# Altium schematic sheet Cpcis_connectors_P4_P5_P6.SchDoc: CPCIS Backplane
size 420 x 297 mm; CheckedBy: A.Paixao; CompanyName: CERN; DrawnBy: G. Daniluk; Engineer: G. Daniluk; Organization: CERN; Address1: European Organization for Nuclear Research; Address2: CH-1211 Genève 23 - Switzerland; DocumentNumber: 19; Revision: -; SheetNumber: 19; SheetTotal: 19; EDA_Number: EDA-03828-V1-0; Projet: DIOT Demonstrator System Board (based on C-GEFE v1); ModifiedBy: G. Daniluk; CheckedDate: 18/06/2018; Title2: P5 to P6; DivGrp: BE/CO; Designer: G. Daniluk; ModifiedDate: -
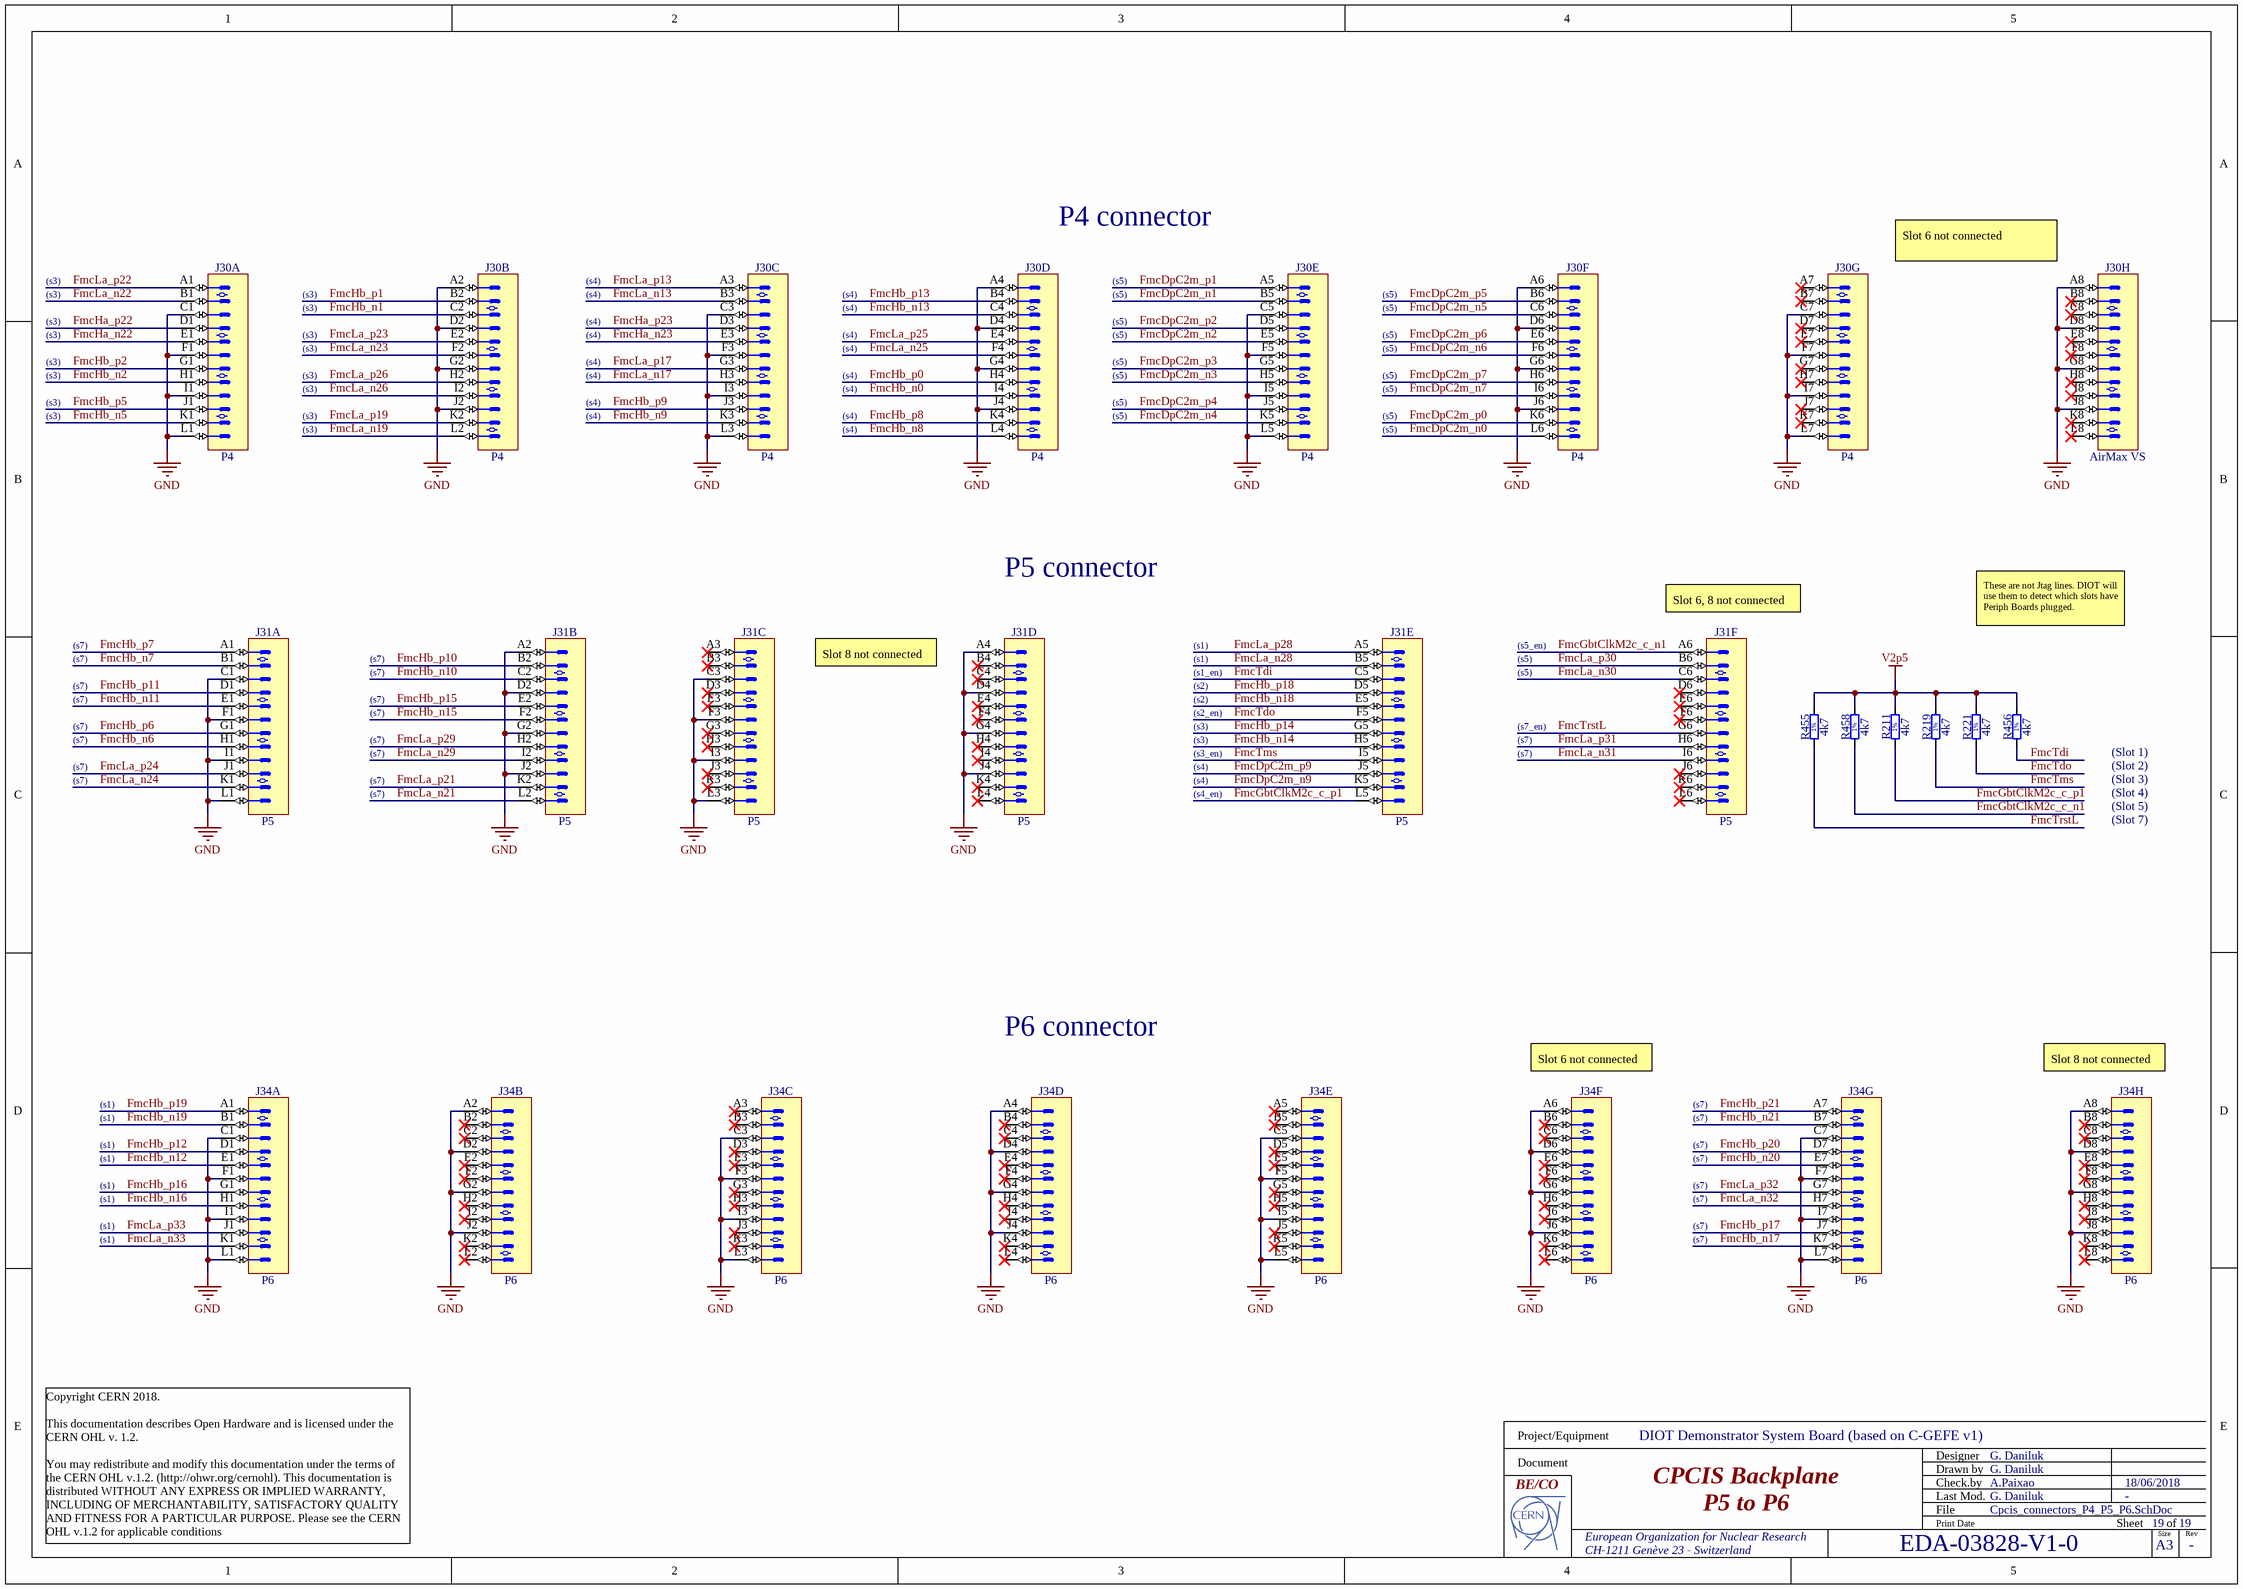
[diagram p0: Cpcis_connectors_P4_P5_P6.SchDoc]

## Parts
J30  P4  [AMPHENOL_10052837-101LF]  (parts A,B,C,D,E,F,G,H of 8)
J31  P5  [AMPHENOL_10052824-101LF]  (parts A,B,C,D,E,F of 6)
J34  P6  [AMPHENOL_10052838-101LF]  (parts A,B,C,D,E,F,G,H of 8)
R211  4k7  [RESC1005X40N]
R219  4k7  [RESC1005X40N]
R221  4k7  [RESC1005X40N]
R455  4k7  [RESC1005X40N]
R456  4k7  [RESC1005X40N]
R458  4k7  [RESC1005X40N]

## Nets
GND: J30.A2 J30.A4 J30.A6 J30.A8 J30.C1 J30.C3 J30.C5 J30.C7 J30.D2 J30.D4 J30.D6 J30.D8 J30.F1 J30.F3 J30.F5 J30.F7 J30.G2 J30.G4 J30.G6 J30.G8 J30.I1 J30.I3 J30.I5 J30.I7 J30.J2 J30.J4 J30.J6 J30.J8 J30.L1 J30.L3 J30.L5 J30.L7 J31.A2 J31.A4 J31.C1 J31.C3 J31.D2 J31.D4 J31.F1 J31.F3 J31.G2 J31.G4 J31.I1 J31.I3 J31.J2 J31.J4 J31.L1 J31.L3 J34.A2 J34.A4 J34.A6 J34.A8 J34.C1 J34.C3 J34.C5 J34.C7 J34.D2 J34.D4 J34.D6 J34.D8 J34.F1 J34.F3 J34.F5 J34.F7 J34.G2 J34.G4 J34.G6 J34.G8 J34.I1 J34.I3 J34.I5 J34.I7 J34.J2 J34.J4 J34.J6 J34.J8 J34.L1 J34.L3 J34.L5 J34.L7
V2p5: R211.2 R219.2 R221.2 R455.2 R456.2 R458.2
FmcDpC2m_n0: J30.L6
FmcDpC2m_n1: J30.B5
FmcDpC2m_n2: J30.E5
FmcDpC2m_n3: J30.H5
FmcDpC2m_n4: J30.K5
FmcDpC2m_n5: J30.C6
FmcDpC2m_n6: J30.F6
FmcDpC2m_n7: J30.I6
FmcDpC2m_n9: J31.K5
FmcDpC2m_p0: J30.K6
FmcDpC2m_p1: J30.A5
FmcDpC2m_p2: J30.D5
FmcDpC2m_p3: J30.G5
FmcDpC2m_p4: J30.J5
FmcDpC2m_p5: J30.B6
FmcDpC2m_p6: J30.E6
FmcDpC2m_p7: J30.H6
FmcDpC2m_p9: J31.J5
FmcGbtClkM2c_c_n1: J31.A6 R458.1
FmcGbtClkM2c_c_p1: J31.L5 R211.1
FmcHa_n22: J30.E1
FmcHa_n23: J30.E3
FmcHa_p22: J30.D1
FmcHa_p23: J30.D3
FmcHb_n0: J30.I4
FmcHb_n1: J30.C2
FmcHb_n2: J30.H1
FmcHb_n5: J30.K1
FmcHb_n6: J31.H1
FmcHb_n7: J31.B1
FmcHb_n8: J30.L4
FmcHb_n9: J30.K3
FmcHb_n10: J31.C2
FmcHb_n11: J31.E1
FmcHb_n12: J34.E1
FmcHb_n13: J30.C4
FmcHb_n14: J31.H5
FmcHb_n15: J31.F2
FmcHb_n16: J34.H1
FmcHb_n17: J34.K7
FmcHb_n18: J31.E5
FmcHb_n19: J34.B1
FmcHb_n20: J34.E7
FmcHb_n21: J34.B7
FmcHb_p0: J30.H4
FmcHb_p1: J30.B2
FmcHb_p2: J30.G1
FmcHb_p5: J30.J1
FmcHb_p6: J31.G1
FmcHb_p7: J31.A1
FmcHb_p8: J30.K4
FmcHb_p9: J30.J3
FmcHb_p10: J31.B2
FmcHb_p11: J31.D1
FmcHb_p12: J34.D1
FmcHb_p13: J30.B4
FmcHb_p14: J31.G5
FmcHb_p15: J31.E2
FmcHb_p16: J34.G1
FmcHb_p17: J34.J7
FmcHb_p18: J31.D5
FmcHb_p19: J34.A1
FmcHb_p20: J34.D7
FmcHb_p21: J34.A7
FmcLa_n13: J30.B3
FmcLa_n17: J30.H3
FmcLa_n19: J30.L2
FmcLa_n21: J31.L2
FmcLa_n22: J30.B1
FmcLa_n23: J30.F2
FmcLa_n24: J31.K1
FmcLa_n25: J30.F4
FmcLa_n26: J30.I2
FmcLa_n28: J31.B5
FmcLa_n29: J31.I2
FmcLa_n30: J31.C6
FmcLa_n31: J31.I6
FmcLa_n32: J34.H7
FmcLa_n33: J34.K1
FmcLa_p13: J30.A3
FmcLa_p17: J30.G3
FmcLa_p19: J30.K2
FmcLa_p21: J31.K2
FmcLa_p22: J30.A1
FmcLa_p23: J30.E2
FmcLa_p24: J31.J1
FmcLa_p25: J30.E4
FmcLa_p26: J30.H2
FmcLa_p28: J31.A5
FmcLa_p29: J31.H2
FmcLa_p30: J31.B6
FmcLa_p31: J31.H6
FmcLa_p32: J34.G7
FmcLa_p33: J34.J1
FmcTdi: J31.C5 R456.1
FmcTdo: J31.F5 R221.1
FmcTms: J31.I5 R219.1
FmcTrstL: J31.G6 R455.1

Not connected (* = marked no-connect by the designer): J30 A7* B7* B8* C8* D7* E7* E8* F8* G7* H7* H8* I8* J7* K7* K8* L8*; J31 A3* B3* B4* C4* D3* D6* E3* E4* E6* F4* F6* G3* H3* H4* I4* J3* J6* K3* K4* K6* L4* L6*; J34 A3* A5* B2* B3* B4* B5* B6* B8* C2* C4* C6* C8* D3* D5* E2* E3* E4* E5* E6* E8* F2* F4* F6* F8* G3* G5* H2* H3* H4* H5* H6* H8* I2* I4* I6* I8* J3* J5* K2* K3* K4* K5* K6* K8* L2* L4* L6* L8*

## Notes on the sheet
- P4 connector
- (near J30) Slot 6 not connected
- (s3)
- (s4)
- (s5)
- P5 connector
- (s7)
- Slot 8 not connected
- (s1)
- (s5_en)
- (near J31) Slot 6, 8 not connected
- These are not Jtag lines. DIOT will use them to detect which slots have Periph Boards plugged.
- (s1_en)
- (s2)
- (s2_en)
- (s7_en)
- (s3_en)
- (s4_en)
- (Slot 1)
- (Slot 2)
- (Slot 3)
- (Slot 4)
- (Slot 7)
- (Slot 5)
- P6 connector
- (near J34) Slot 6 not connected
- (near J34) Slot 8 not connected
- Copyright CERN 2018.
  This documentation describes Open Hardware and is licensed under the CERN OHL v. 1.2.
  You may redistribute and modify this documentation under the terms of the CERN OHL v.1.2. (http://ohwr.org/cernohl). This documentation is distributed WITHOUT ANY EXPRESS OR IMPLIED WARRANTY, INCLUDING OF MERCHANTABILITY, SATISFACTORY QUALITY AND FITNESS FOR A PARTICULAR PURPOSE. Please see the CERN OHL v.1.2 for applicable conditions
- Project/Equipment
- Document
- Designer
- Drawn by
- Check.by
- File
- Last Mod.
- Print Date
- Sheet
- Size
- A3
- of
- Rev
- (in symbol R0402_4K7_1%_0.0625W_100PPM) 1%

## Library data of the parts
J30 = AMPHENOL_10052837-101LF: 96 Contacts Header, 8 Columns, 4 Pairs per Column; Part Description: 96 Contacts, 2mm Pitch, 8 Columns, 4 Pairs per Column, 2 Walls, Right Angle Header; Part Number: AMPHENOL_10052837-101LF; Component Kind: Standard; Component Type: Standard; Pin Count: 96; Family: AirMax VS; Mounted: Yes; Socket: No; SMD: No; PressFit: Yes; Sense: No; Status: None; Manufacturer: AMPHENOL; Manufacturer Part Number: 10052837-101LF; ComponentHeight: 15.35mm; HelpURL: \\cern.ch\dfs\Applications\Altium\Datasheets\AMPHENOL_10052837-101LF.pdf; ComponentLink1URL: \\cern.ch\dfs\Applications\Altium\Datasheets\AMPHENOL_10052837-101LF_Application.pdf; ComponentLink1Description: Application; Author: CERN DEM MR; CreateDate: 19/02/2018; LatestRevisionDate: 19/02/2018
J31 = AMPHENOL_10052824-101LF: 72 Contacts Header, 6 Columns, 4 Pairs per Column; Part Description: 72 Contacts, 2mm Pitch, 6 Columns, 4 Pairs per Column, 2 Walls, Right Angle Header; Part Number: AMPHENOL_10052824-101LF; Component Kind: Standard; Component Type: Standard; Pin Count: 72; Family: AirMax VS; Mounted: Yes; Socket: No; SMD: No; PressFit: Yes; Sense: No; Status: None; Manufacturer: AMPHENOL; Manufacturer Part Number: 10052824-101LF; ComponentHeight: 15.35mm; HelpURL: \\cern.ch\dfs\Applications\Altium\Datasheets\AMPHENOL_10052824-101LF.pdf; ComponentLink1URL: \\cern.ch\dfs\Applications\Altium\Datasheets\AMPHENOL_10052824-101LF_Application.pdf; ComponentLink1Description: Application; Author: CERN DEM JMW; CreateDate: 29/11/2017; LatestRevisionDate: 29/11/2017
J34 = AMPHENOL_10052838-101LF: 96 Contacts Header, 8 Columns, 4 Pairs per Column; Part Description: 96 Contacts, 2mm Pitch, 8 Columns, 4 Pairs per Column, 4 Walls, Right Angle Header; Part Number: AMPHENOL_10052838-101LF; Component Kind: Standard; Component Type: Standard; Pin Count: 96; Family: AirMax VS; Mounted: Yes; Socket: No; SMD: No; PressFit: Yes; Sense: No; Status: None; Manufacturer: AMPHENOL; Manufacturer Part Number: 10052838-101LF; ComponentHeight: 15.35mm; HelpURL: \\cern.ch\dfs\Applications\Altium\Datasheets\AMPHENOL_10052838-101LF.pdf; ComponentLink1URL: \\cern.ch\dfs\Applications\Altium\Datasheets\AMPHENOL_10052838-101LF_Application.pdf; ComponentLink1Description: Application; Author: CERN DEM MR; CreateDate: 19/02/2018; LatestRevisionDate: 19/02/2018; Classname: Overlapping
R211 R219 R221 R455 R456 R458 = R0402_4K7_1%_0.0625W_100PPM: Resistor - 1%; Part Description: General Purpose Thick Film Chip Resistor; Manufacturer: GENERIC; Manufacturer1 Part Number: 232270674702L; TC: ±100ppm/°C; PressFit: No; Part Number: R0402_4K7_1%_0.0625W_100PPM; Component Kind: Standard; Component Type: Standard; Pin Count: 2; Value: 4k7; Status: Not Recommended; Power: 0.0625W; Tolerance: ±1%; Manufacturer Part Number: R0402_4K7_1%_0.0625W_100PPM; Case: 0402; Mounted: Yes; Sense: No; Socket: No; SMD: Yes; Manufacturer1 Example: YAGEO PHYCOMP; Manufacturer1 ComponentHeight: 0.4mm; HelpURL: \\cern.ch\dfs\Applications\Altium\Datasheets\R0402_Phycomp_RC0402.pdf; Author: CERN DEM JLC; CreateDate: 03/12/2007; LatestRevisionDate: 17/10/2012